# EAGLE design SP (EAGLE 7.1.0)

## Sheet 1 of 2
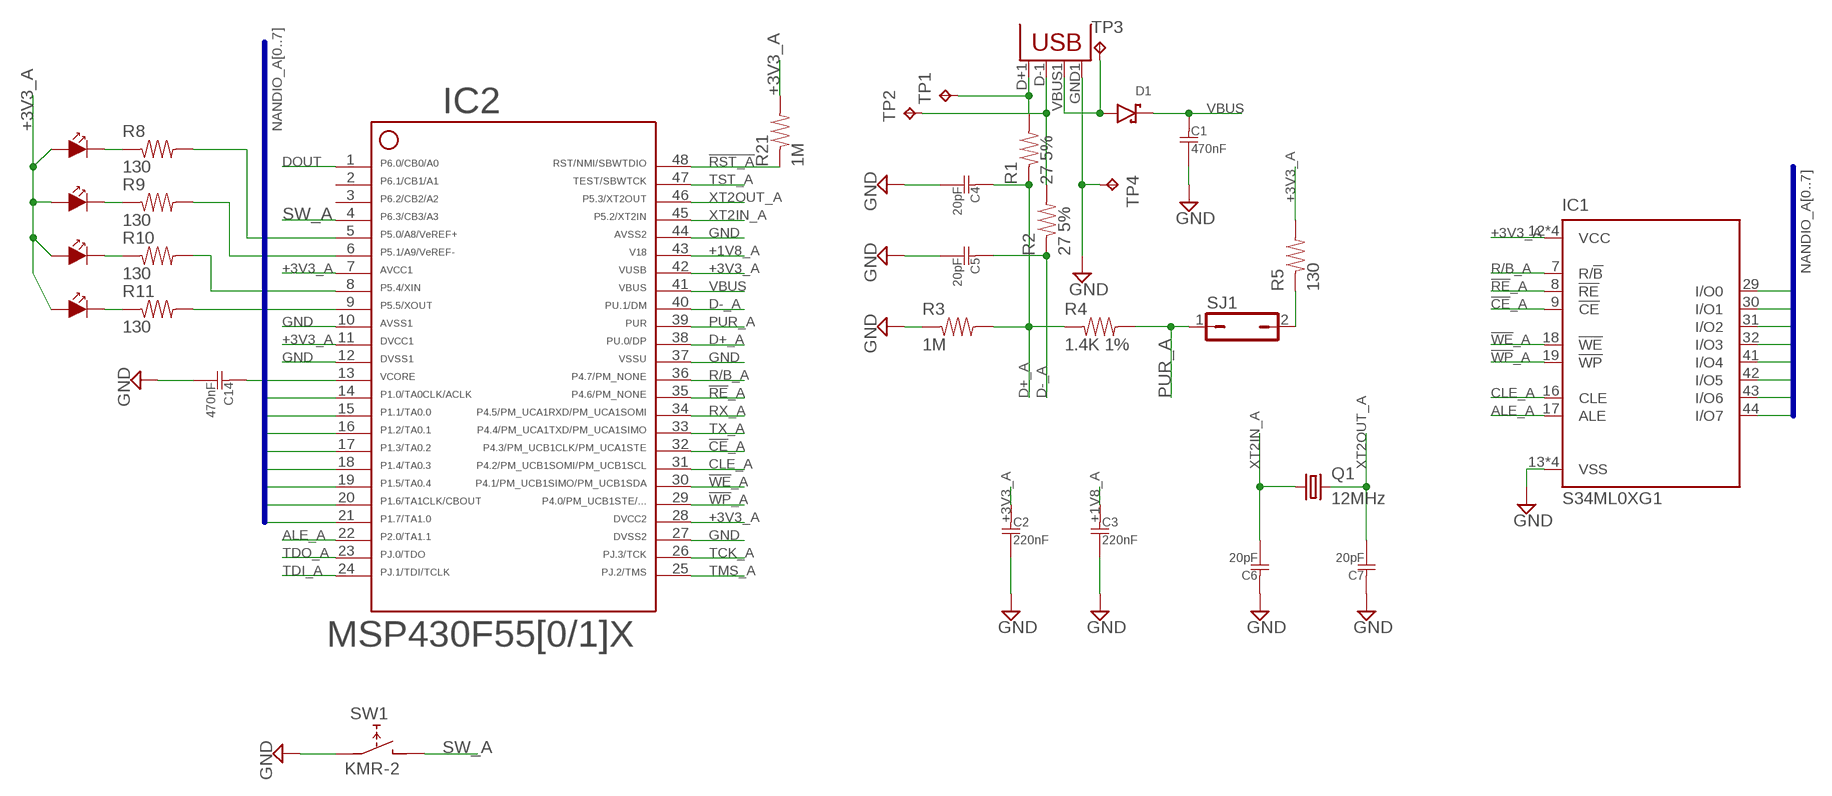
[diagram p0: schematic, sheet 1]

### Parts
C1  470nF  C0805  [R0805]
C2  220nF  C0805  [R0805]
C3  220nF  C0805  [R0805]
C4  20pF  C0805  [R0805]
C5  20pF  C0805  [R0805]
C6  20pF  C0805  [R0805]
C7  20pF  C0805  [R0805]
C14  470nF  C0805  [R0805]
D1  D-SCHOTTKY  [SOD123]
IC1  S34ML0XG1  [TSOP48]
IC2  F5508  F55[0/1]X---PT48  [PT48]
JP1  USBA-SMD-MALE  [USB-A-SMT-MALE]
Q1  12MHz  CRYSTALCSM-3X  [CSM-3X]
R1  27 5%  R0805  [R0805]
R2  27 5%  R0805  [R0805]
R3  1M  R0805  [R0805]
R4  1.4K 1%  R0805  [R0805]
R5  130  R0805  [R0805]
R8  130  R0805  [R0805]
R9  130  R0805  [R0805]
R10  130  R0805  [R0805]
R11  130  R0805  [R0805]
R21  1M  R0805  [R0805]
SJ1  JP1Q  [JP1]
SW1  KMR-2  [KMR-2-SWITCH]
TP1  TPTP13R  [TP13R]
TP2  TPTP13R  [TP13R]
TP3  TPTP13R  [TP13R]
TP4  TPTP13R  [TP13R]
U$5  LED  [LED0805]
U$6  LED  [LED0805]
U$7  LED  [LED0805]
U$8  LED  [LED0805]

### Nets
!CE!_A: IC1.9(!CE) IC2.32
!RE!_A: IC1.8(!RE) IC2.35
!RST_A!: IC2.48 R21.P$1
!WE!_A: IC1.18(!WE) IC2.30
!WP!_A: IC1.19(!WP) IC2.29
+1V8_A: C3.P$1 IC2.43
+3V3_A: C2.P$1 IC1.12(VCC) IC1.34(VCC) IC1.37(VCC) IC1.39(VCC) IC2.7 IC2.11 IC2.28 IC2.42 R5.P$2 R21.P$2 U$5.ANODE U$6.ANODE U$7.ANODE U$8.ANODE
ALE_A: IC1.17(ALE) IC2.22
CLE_A: IC1.16(CLE) IC2.31
D+_A: C4.P$1 IC2.38 R1.P$1 R3.P$2 R4.P$1
D-_A: C5.P$1 IC2.40 R2.P$1
DOUT: IC2.1 ; also sheet 2
GND: C1.P$2 C2.P$2 C3.P$2 C4.P$2 C5.P$2 C6.P$1 C7.P$1 C14.P$2 IC1.13(VSS) IC1.25(VSS) IC1.36(VSS) IC1.48(VSS) IC2.10 IC2.12 IC2.27 IC2.37 IC2.44 JP1.GND1(GND) R3.P$1 SW1.PA1(A1) SW1.PA2(A1) TP4.TP ; also sheet 2
N$1: JP1.D+1(D+) R1.P$2 TP1.TP
N$2: JP1.D-1(D-) R2.P$2 TP2.TP
N$3: C14.P$1 IC2.13
N$4: R5.P$1 SJ1.2
N$19: IC2.9 R11.P$2
N$22: R10.P$1 U$7.CATHODE
N$23: R9.P$1 U$6.CATHODE
N$24: R8.P$1 U$5.CATHODE
N$25: R11.P$1 U$8.CATHODE
N$26: IC2.8 R10.P$2
N$27: IC2.6 R9.P$2
N$28: IC2.5 R8.P$2
N$33: D1.ANODE JP1.VBUS1(VBUS) TP3.TP
NANDIO_A0: IC1.29(I/O0) IC2.14
NANDIO_A1: IC1.30(I/O1) IC2.15
NANDIO_A2: IC1.31(I/O2) IC2.16
NANDIO_A3: IC1.32(I/O3) IC2.17
NANDIO_A4: IC1.41(I/O4) IC2.18
NANDIO_A5: IC1.42(I/O5) IC2.19
NANDIO_A6: IC1.43(I/O6) IC2.20
NANDIO_A7: IC1.44(I/O7) IC2.21
PUR_A: IC2.39 R4.P$2 SJ1.1
R/B_A: IC1.7(R/!B) IC2.36
RX_A: IC2.34 ; also sheet 2
SW_A: IC2.4 SW1.PB1(B) SW1.PB2(B)
TCK_A: IC2.26
TDI_A: IC2.24
TDO_A: IC2.23
TMS_A: IC2.25
TST_A: IC2.47
TX_A: IC2.33 ; also sheet 2
VBUS: C1.P$1 D1.CATHODE IC2.41 ; also sheet 2
XT2IN_A: C6.P$2 IC2.45 Q1.P$1
XT2OUT_A: C7.P$2 IC2.46 Q1.P$2
Unconnected: IC2.2 IC2.3

### Buses
NANDIO_A[0..7]

## Sheet 2 of 2
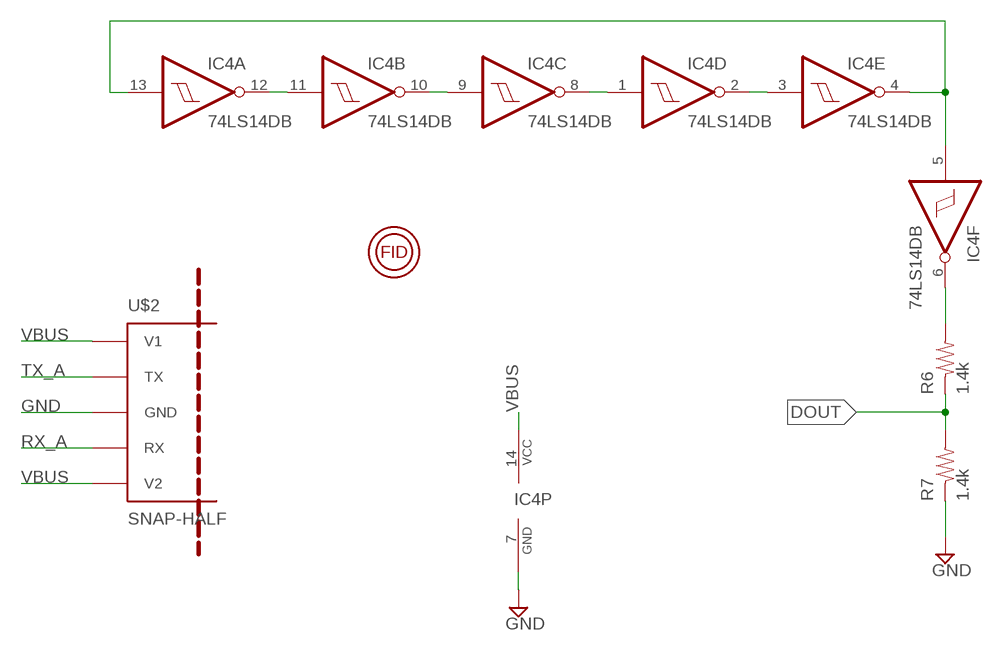
[diagram p1: schematic, sheet 2]

### Parts
IC4  74LS14DB  [SSOP14]
R6  1.4k  R0805  [R0805]
R7  1.4k  R0805  [R0805]
U$2  SNAP-HALF  [SNAP-HALF]
U$3  FIDUCAL  [FIDUCAL]

### Nets
DOUT: R6.P$1 R7.P$2 ; also sheet 1
GND: IC4.7(P:GND) R7.P$1 U$2.P$3(GND) ; also sheet 1
N$5: IC4.11(B:I) IC4.12(A:O)
N$6: IC4.9(C:I) IC4.10(B:O)
N$7: IC4.1(D:I) IC4.8(C:O)
N$8: IC4.2(D:O) IC4.3(E:I)
N$9: IC4.4(E:O) IC4.5(F:I) IC4.13(A:I)
N$10: IC4.6(F:O) R6.P$2
RX_A: U$2.P$4(RX) ; also sheet 1
TX_A: U$2.P$2(TX) ; also sheet 1
VBUS: IC4.14(P:VCC) U$2.P$1(V1) U$2.P$5(V2) ; also sheet 1

## Library data of the parts
C1-C7 C14 = Passives:C
D1 = Passives:D-SCHOTTKY
IC1 = Flash:S34ML0XG1: Spansion 1GB, 2GB, and 4GB x8 NAND Flash Memory In x8 I/O mode
IC2 = TI_MSP430_v16:F55[0/1]X---PT48: ***F55[0/1/2]X*** PT48 Rev. 1.0 06/2010 "http://www.ti.com/lit/gpn/msp430f5509" Only for FF5504, F5508,F5509,F5510
IC4 = 74xx-db-us:74*14: Hex schmitt trigger INVERTER
JP1 = Passives:USB: USB Connectors USB-B-PTH is fully proven SKU : PRT-00139/CONN-08278 USB-miniB is fully proven SKU : PRT-00587 USB-A-PCB is untested. USB-A-H is throughly reviewed, but untested. Spark Fun Electronics SKU : PRT-00437 USB-B-SMT is throughly reviewed, but untested. Needs silkscreen touching up. USB-A-S has not been used/tested USB-MB-H has not been used/tested USB-MICROB has been used. CONN-09505
Q1 = Passives:CRYSTAL: CRYSTAL
R1-R11 R21 = Passives:R: A standard resistor.
SJ1 = jumper:JP1Q: JUMPER
SW1 = Passives:KMR-2
TP1-TP4 = testpad:TP: Test pad
U$2 = Passives:SNAP-HALF
U$3 = Passives:FIDUCAL
U$5-U$8 = Passives:LED

## Board
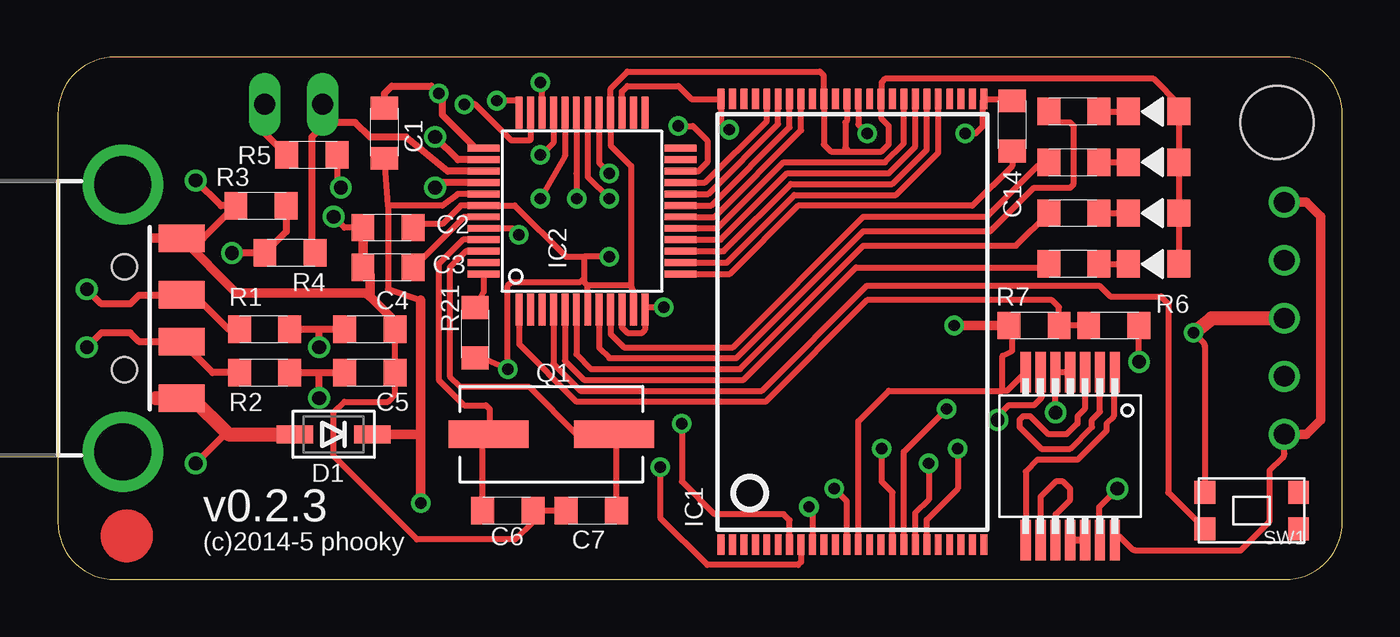
[diagram p2: board, top side]
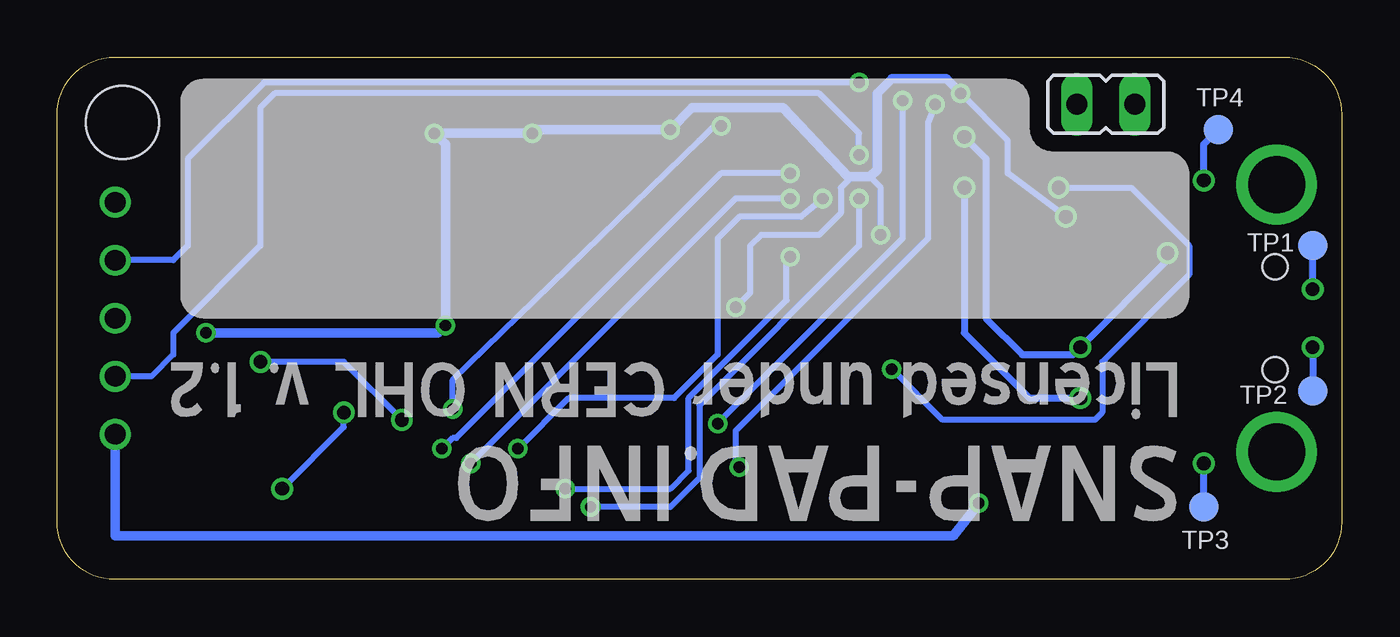
[diagram p3: board, bottom side, seen from below]

Size 56.2 x 22.86 mm. Coordinates in mm from the lower left corner, seen from the top.
Outline: 0,20.36 0,2.5 arc90 2.5,0 53.7,0 arc90 56.2,2.5 56.2,20.36 arc90 53.7,22.86 2.5,22.86 arc90 0,20.36
Copper layers (1*16): Top 0.0356mm / dielectric 1.5011mm / Bottom 0.0356mm
Design rules "LaenPCBOrder": minimum track width 6mil, minimum drill 13mil, track to track 6mil, track to pad 6mil, pad to pad 6mil, via to via 6mil, smd to smd 6mil, copper to edge 15mil, drill to drill 6mil, minimum pad ring 7mil, minimum via ring 7mil, stop-mask expansion 3mil, vias tented up to drill 0mil, thermal gap 10mil
Holes 3.2 mm at 53.34,20

### Footprints (pad centres in the part's own frame; a part is rotated, then mirrored left to right if it is on the bottom)
R0805 = smd 1 x 1.2: P$1 1.1,0; P$2 -1.1,0
SOD123 = smd 1.6 x 0.8: ANODE 1.7,0; CATHODE -1.7,0
TSOP48 = smd 0.9 x 0.3: 1 -9.75,5.75; 2 -9.75,5.25; 3 -9.75,4.75; 4 -9.75,4.25; 5 -9.75,3.75; 6 -9.75,3.25; 7 -9.75,2.75; 8 -9.75,2.25; 9 -9.75,1.75; 10 -9.75,1.25; 11 -9.75,0.75; 12 -9.75,0.25; 13 -9.75,-0.25; 14 -9.75,-0.75; 15 -9.75,-1.25; 16 -9.75,-1.75; 17 -9.75,-2.25; 18 -9.75,-2.75; 19 -9.75,-3.25; 20 -9.75,-3.75; 21 -9.75,-4.25; 22 -9.75,-4.75; 23 -9.75,-5.25; 24 -9.75,-5.75; 25 9.75,-5.75; 26 9.75,-5.25; 27 9.75,-4.75; 28 9.75,-4.25; 29 9.75,-3.75; 30 9.75,-3.25; 31 9.75,-2.75; 32 9.75,-2.25; 33 9.75,-1.75; 34 9.75,-1.25; 35 9.75,-0.75; 36 9.75,-0.25; 37 9.75,0.25; 38 9.75,0.75; 39 9.75,1.25; 40 9.75,1.75; 41 9.75,2.25; 42 9.75,2.75; 43 9.75,3.25; 44 9.75,3.75; 45 9.75,4.25; 46 9.75,4.75; 47 9.75,5.25; 48 9.75,5.75
PT48 = smd 1.4 x 0.3: 1 -4.3,2.75; 2 -4.3,2.25; 3 -4.3,1.75; 4 -4.3,1.25; 5 -4.3,0.75; 6 -4.3,0.25; 7 -4.3,-0.25; 8 -4.3,-0.75; 9 -4.3,-1.25; 10 -4.3,-1.75; 11 -4.3,-2.25; 12 -4.3,-2.75; 25 4.3,-2.75; 26 4.3,-2.25; 27 4.3,-1.75; 28 4.3,-1.25; 29 4.3,-0.75; 30 4.3,-0.25; 31 4.3,0.25; 32 4.3,0.75; 33 4.3,1.25; 34 4.3,1.75; 35 4.3,2.25; 36 4.3,2.75 | smd 0.3 x 1.4: 13 -2.75,-4.3; 14 -2.25,-4.3; 15 -1.75,-4.3; 16 -1.25,-4.3; 17 -0.75,-4.3; 18 -0.25,-4.3; 19 0.25,-4.3; 20 0.75,-4.3; 21 1.25,-4.3; 22 1.75,-4.3; 23 2.25,-4.3; 24 2.75,-4.3; 37 2.75,4.3; 38 2.25,4.3; 39 1.75,4.3; 40 1.25,4.3; 41 0.75,4.3; 42 0.25,4.3; 43 -0.25,4.3; 44 -0.75,4.3; 45 -1.25,4.3; 46 -1.75,4.3; 47 -2.25,4.3; 48 -2.75,4.3
SSOP14 = smd 0.451 x 1.766: 1 -1.95,-3.675; 2 -1.3,-3.675; 3 -0.65,-3.675; 4 0,-3.675; 5 0.65,-3.675; 6 1.3,-3.675; 7 1.95,-3.675; 8 1.95,3.675; 9 1.3,3.675; 10 0.65,3.675; 11 0,3.675; 12 -0.65,3.675; 13 -1.3,3.675; 14 -1.95,3.675
USB-A-SMT-MALE = smd 1.2 x 2: D+1 1.027,-3.67; D-1 -1.027,-3.67; GND1 3.5,-3.67; VBUS1 -3.5,-3.67 | drill 2.5 pad 2.9: P$1 -5.85,-1.1; P$2 5.85,-1.1 | hole 1.1: 2.25,-1.17; -2.25,-1.17
CSM-3X = smd 3.5 x 1.2: P$1 -2.75,0; P$2 2.75,0
JP1 = drill 0.914 long: 1 0,-1.27; 2 0,1.27
KMR-2-SWITCH = smd 0.9 x 1: PA1 -2.05,-0.8; PA2 2.05,-0.8; PB1 -2.05,0.8; PB2 2.05,0.8
TP13R = smd 1.3 x 1.3: TP 0,0
SNAP-HALF = drill 0.9: P$1 -3.81,5.08; P$2 -3.81,2.54; P$3 -3.81,0; P$4 -3.81,-2.54; P$5 -3.81,-5.08
LED0805 = smd 1 x 1.2: ANODE -1.1,0; CATHODE 1.1,0

### Placement (x,y rotation side)
C1  14.29,19.53 270 top
C2  14.45,15.4 0 top
C3  14.45,13.65 0 top
C4  13.65,10.95 180 top
C5  13.65,9.05 180 top
C6  19.68,3.02 0 top
C7  23.34,3.02 180 top
C14  41.75,19.84 270 top
D1  12.07,6.35 180 top
IC1  34.77,11.27 90 top
IC2  22.93,16.12 90 top
IC4  44.29,5.4 180 top
JP1  1.75,11.43 90 top
Q1  21.59,6.35 0 top
R1  9.05,10.95 0 top
R2  9.05,9.05 0 top
R3  8.89,16.35 180 top
R4  10.16,14.29 180 top
R5  11.11,18.57 180 top
R6  46.2,11.11 180 top
R7  42.7,11.11 180 top
R8  44.45,13.81 0 top
R9  44.45,16.03 0 top
R10  44.45,20.48 0 top
R11  44.45,18.26 0 top
R21  18.26,10.79 90 top
SJ1  10.32,20.8 270 bottom
SW1  52.23,3.02 180 top
TP1  1.27,14.61 0 bottom
TP2  1.27,8.26 0 bottom
TP3  6.03,3.17 0 bottom
TP4  5.4,19.68 0 bottom
U$2  57.47,11.43 180 bottom
U$3  3.02,1.91 0 top
U$5  47.94,13.81 180 top
U$6  47.94,16.03 180 top
U$7  47.94,20.48 180 top
U$8  47.94,18.26 180 top

### Tracks (layer width: path | path; a pad name or v marks a point on that pad's centre or on a via)
!CE!_A  (via drill 0.5)
  Top 0.254: IC2.32 22.18,18.53 v21.11,16.67 | v32.86,3.17 33.02,3.02 IC1.9
  Bottom 0.254: v21.11,16.67 21.11,14.61 28.1,7.62 28.1,4.45 29.37,3.17 v32.86,3.17
!RE!_A  (via drill 0.5)
  Top 0.254: IC2.35 20.68,19.25 20.64,19.21 19.84,19.21 18.26,20.8 v17.78,20.8 | v26.35,4.92 26.35,2.7 28.42,0.64 32.38,0.64 32.52,0.77 IC1.8
  Bottom 0.254: v17.78,20.8 18.1,20 18.1,14.92 26.51,6.51 26.51,5.08 v26.35,4.92
!RST_A!
  Top 0.254: IC2.48 18.63,12.59 R21.P$1
!WE!_A  (via drill 0.5)
  Top 0.254: IC2.30 23.18,17.61 v24.13,16.67 | v38.1,5.08 38.1,3.49 37.52,2.91 IC1.18
  Bottom 0.254: v24.13,16.67 26.51,16.67 v38.1,5.08
!WP!_A  (via drill 0.5)
  Top 0.254: IC2.29 23.68,18.23 v24.13,17.78 | v39.37,5.71 39.37,3.97 38.02,2.62 IC1.19
  Bottom 0.254: v24.13,17.78 27.15,17.78 38.73,6.19 38.89,6.19 v39.37,5.71
+1V8_A
  Top 0.254: IC2.43 17.77,15.87 C3.P$1
+3V3_A  (via drill 0.5, 0.6)
  Top 0.254: IC2.11 25.18,12.6 25.08,12.86 | 25.08,12.86 23.18,12.86 | IC2.7 23.18,12.55 23.18,12.86 | U$5.ANODE U$6.ANODE U$8.ANODE U$7.ANODE 49.04,20.81 47.94,21.91 36.2,21.91 36.04,21.75 36.04,21.04 IC1.34 36.04,21 36.04,20.16 36.35,19.84 36.35,19.05 36.04,18.73 34.61,18.73 | IC1.37 34.52,20.07 34.45,20 34.45,18.89 34.61,18.73 | 34.61,18.73 33.81,18.73 33.52,19.03 IC1.39 33.5,21.04 33.5,22.07 33.34,22.23 24.92,22.23 24.18,21.48 IC2.28 24.18,19 25.08,18.1 25.08,12.86 | 23.18,12.86 23.02,13.02 23.02,13.18 | 23.02,14.13 22.23,14.13 19.98,16.37 IC2.42 17.64,16.37 16.83,15.56 15.71,15.56 C2.P$1 | 23.02,14.13 23.02,13.18 | IC1.12 34.52,3.42 v33.97,3.97 | v24.13,14.13 23.02,14.13 | R21.P$2 18.59,9.7 v19.68,9.21 19.68,12.86 19.84,13.02 22.86,13.02 23.02,13.18 | R5.P$2 12.21,17.32 v12.38,17.14
  Bottom 0.254: v33.97,3.97 29.37,3.97 28.57,4.76 28.57,7.94 24.29,12.22 24.29,13.97 v24.13,14.13 | v19.68,9.21 17.46,6.99 10.79,6.99 10.48,7.3 10.48,9.53 6.67,13.34 6.67,14.61 9.21,17.14 v12.38,17.14
ALE_A  (via drill 0.5)
  Top 0.254: IC1.17 37.02,5.58 v38.89,7.46 | v27.15,19.84 27.78,19.84 28.42,19.21 28.42,18.26 28.03,17.87 IC2.22
  Bottom 0.254: v38.89,7.46 38.89,8.73 28.1,19.21 27.46,19.84 v27.15,19.84
CLE_A  (via drill 0.5)
  Top 0.254: IC2.31 22.68,17.76 v22.7,16.67 | IC1.16 36.52,3.81 36.04,4.29 v36.04,5.71
  Bottom 0.254: v22.7,16.67 23.65,15.88 26.35,15.88 27.3,14.92 27.3,9.84 29.21,7.94 33.81,7.94 v36.04,5.71
D+_A  (via drill 0.6)
  Top 0.305: R1.P$1 11.43,10.95 | 11.43,10.95 C4.P$1 | IC2.38 17.51,18.37 v16.51,19.37 | v11.43,10.16 11.43,10.95 | R3.P$2 9.99,15.22 R4.P$1 v7.62,14.29
  Bottom 0.305: v16.51,19.37 15.56,18.41 15.56,11.43 13.97,9.84 11.75,9.84 v11.43,10.16 7.62,13.97 v7.62,14.29
D-_A  (via drill 0.6)
  Top 0.305: R2.P$1 11.43,9.05 | 11.43,9.05 C5.P$1 | IC2.40 16.73,17.37 v16.51,17.14 | v11.43,7.94 11.43,9.05
  Bottom 0.305: v16.51,17.14 16.51,10.79 13.65,7.94 v11.43,7.94
DOUT
  Top 0.254: IC2.1 20.18,10.3 22.7,7.78 30.96,7.78 35.4,12.22 43.5,12.22 43.8,11.92 R7.P$2 R6.P$1
GND  (via drill 0.5, 0.6)
  Top 0.254: IC2.10 24.68,11.04 24.92,10.79 25.56,10.79 25.68,10.92 IC2.12 25.77,11.91 v26.51,11.91 | IC1.36 35.02,19.91 v35.4,19.53 | v39.69,19.53 40.16,19.53 40.48,19.84 40.48,20.99 IC1.25 41.67,21.02 C14.P$2 | IC1.13 35.02,6.92 36.35,8.26 41.33,8.26 | IC2.27 24.68,21.35 24.92,21.59 27.15,21.59 27.71,21.02 IC1.48 29.02,20.04 v29.37,19.68 | IC2.37 18.44,18.87 | C4.P$2 C5.P$2 14.76,9.04 14.76,8.1 14.45,7.78 12.54,7.78 12.07,7.3 12.07,5.4 15.72,1.75 20,1.75 20.79,2.53 C6.P$1 C7.P$1 | 41.33,8.26 41.33,9.79 41.75,10 41.75,10.96 R7.P$1 | IC2.44 19.87,15.37 v20.16,15.08 | C2.P$2 12.54,15.4 v12.07,15.88 | IC4.7 41.52,8.26 41.33,8.26 | v49.69,10.79 50.1,10.38 arc-45 50.18,10.2 SW1.PA2
  Top 0.305: IC2.37 18.28,18.87 16.83,20.32 16.83,21.11 v16.67,21.27 16.35,21.59 14.61,21.59 14.29,21.27 C1.P$2 | JP1.GND1 6.37,14.93 R3.P$1 7.14,16.35 v6.03,17.46
  Top 0.406: 4.13,14.93 JP1.GND1 7.8,12.54 13.49,12.54 13.65,12.38 | C2.P$2 C3.P$2 13.65,13.35 13.65,12.38 | v39.21,11.11 R7.P$1 | C4.P$2 14.75,11.28 13.65,12.38
  Top 0.61: U$2.P$3 50.48,11.43 v49.69,10.79
  Bottom 0.254: 35.24,19.68 v35.4,19.53 | 21.59,17.62 21.59,17.46 21.91,17.14 21.91,16.03 22.86,15.08 25.4,15.08 25.88,14.61 25.88,12.54 v26.51,11.91 | v20.16,15.08 20.16,17.14 20.64,17.62 | v12.07,15.88 14.61,17.78 14.61,19.21 v16.67,21.27
  Bottom 0.305: v6.03,17.46 6.03,19.05 TP4.TP
  Bottom 0.406: v35.4,19.53 v39.69,19.53 39.21,19.05 v39.21,11.11 39.53,10.79 v49.69,10.79 | 35.24,19.68 v29.37,19.68 28.42,20.64 24.45,20.64 21.59,17.62 20.64,17.62 20.32,17.94 20.32,21.27 19.68,21.91 17.3,21.91 v16.67,21.27
N$1  (via drill 0.6)
  Top 0.254: JP1.D+1 4.57,12.43
  Top 0.305: 4.57,12.43 3.54,12.43 3.18,12.06 1.9,12.06 v1.27,12.7 | R1.P$2 7.46,10.95 6.03,12.38 5.49,12.38 JP1.D+1
  Bottom 0.305: v1.27,12.7 TP1.TP
N$2  (via drill 0.6)
  Top 0.254: JP1.D-1 4.66,10.43
  Top 0.305: v1.27,10.16 1.9,10.79 3.18,10.79 3.57,10.4 JP1.D-1 6.77,9.05 R2.P$2
  Bottom 0.305: v1.27,10.16 TP2.TP
N$3
  Top 0.254: C14.P$1 41.75,18.1 40,16.35 32.38,16.35 29.4,13.37 IC2.13
N$4
  Top 0.305: SJ1.2 9.05,19.54 R5.P$1
N$5
  Top 0.305: IC4.11 IC4.12
N$6
  Top 0.254: IC4.10 43.66,1.74 43.66,2.86 44.29,3.49 44.29,3.97 43.97,4.29 43.66,4.29 42.99,3.62 IC4.9
N$7
  Top 0.254: IC4.1 46.2,9.03 46.2,7.14 45.88,6.83 45.88,6.51 44.61,5.24 42.86,5.24 42.34,4.72 IC4.8
N$8
  Top 0.254: IC4.3 44.93,9.06 44.93,7.46 44.61,7.14 44.61,6.83 44.13,6.35 43.34,6.35 42.54,7.14 42.23,7.14 42.07,6.99 42.07,6.67 43.02,5.71 44.29,5.71 45.24,6.67 45.24,6.99 45.59,7.33 IC4.2
N$9  (via drill 0.6)
  Top 0.254: IC4.13 45.56,1.75 45.56,3.17 v46.35,3.97 | v43.66,7.3 43.64,7.32 IC4.5 IC4.4
  Bottom 0.254: v46.35,3.97 43.66,6.67 v43.66,7.3
N$10  (via drill 0.6)
  Top 0.254: IC4.6 43.02,9.04 43.02,7.94 42.7,7.62 41.59,7.62 41.12,7.14 v41.12,6.99 | v47.31,9.53 47.3,9.54 R6.P$2
  Bottom 0.254: v41.12,6.99 43.66,9.53 v47.31,9.53
N$19
  Top 0.254: IC2.9 24.18,10.74 24.77,10.16 29.53,10.16 35.24,15.88 40.64,15.88 42.86,18.1 43.19,18.1 R11.P$2
N$22
  Top 0.254: R10.P$1 U$7.CATHODE
N$23
  Top 0.254: R9.P$1 U$6.CATHODE
N$24
  Top 0.254: R8.P$1 U$5.CATHODE
N$25
  Top 0.254: R11.P$1 U$8.CATHODE
N$26
  Top 0.254: IC2.8 23.68,10.13 24.13,9.68 29.69,9.68 35.24,15.24 40.8,15.24 42.7,17.14 44.29,17.14 44.45,17.3 44.45,19.84 44.29,20 43.83,20 R10.P$2
N$27
  Top 0.254: IC2.6 22.68,9.86 23.34,9.21 29.84,9.21 35.24,14.61 41.92,14.61 R9.P$2
N$28
  Top 0.254: IC2.5 22.18,9.57 23.02,8.73 30,8.73 34.92,13.65 43.03,13.65 R8.P$2
N$33  (via drill 0.6)
  Top 0.305: v6.03,5.08 7.38,6.43
  Top 0.61: 4.29,7.93 JP1.VBUS1 5.88,7.93 7.38,6.43 7.46,6.35 D1.ANODE
  Bottom 0.305: TP3.TP v6.03,5.08
NANDIO_A0
  Top 0.254: IC2.14 29.27,13.87 32.23,16.83 36.67,16.83 38.52,18.67 IC1.29
NANDIO_A1
  Top 0.254: IC2.15 29.13,14.37 32.07,17.3 36.51,17.3 38.02,18.81 IC1.30
NANDIO_A2
  Top 0.254: IC2.16 29,14.87 31.91,17.78 36.35,17.78 37.52,18.94 IC1.31
NANDIO_A3
  Top 0.254: IC2.17 28.86,15.37 31.75,18.26 36.2,18.26 37.02,19.08 IC1.32
NANDIO_A4
  Top 0.254: IC2.18 28.73,15.87 32.52,19.66 IC1.41
NANDIO_A5
  Top 0.254: IC2.19 28.59,16.37 32.02,19.79 IC1.42
NANDIO_A6
  Top 0.254: IC2.20 28.46,16.87 31.52,19.93 IC1.43
NANDIO_A7
  Top 0.254: IC2.21 28.32,17.37 31.02,20.06 IC1.44
PUR_A
  Top 0.305: SJ1.1 11.59,20 | 11.59,20 11.59,19.84 11.11,19.37 11.11,14.44 R4.P$2 | IC2.39 17.06,17.87 15.24,19.37 13.65,19.37 13.02,20 11.59,20
R/B_A  (via drill 0.5)
  Top 0.254: IC2.36 20.18,20.61 20.16,20.95 v19.21,20.95 | v27.3,6.83 27.3,4.29 28.73,2.86 31.75,2.86 32.02,2.59 IC1.7
  Bottom 0.254: v19.21,20.95 19.21,14.92 v27.3,6.83
RX_A  (via drill 0.5)
  Top 0.254: IC2.34 21.18,21.36 v21.11,21.75
  Bottom 0.254: v21.11,21.75 47.15,21.75 50.48,18.41 50.48,14.61 51.12,13.97 U$2.P$4
SW_A
  Top 0.254: IC2.4 21.68,9.43 22.86,8.26 30.8,8.26 35.4,12.86 45.56,12.86 46.04,12.38 48.26,12.38 48.58,12.06 48.58,3.79 arc-45 48.62,3.77 SW1.PB2
TX_A  (via drill 0.5)
  Top 0.254: IC2.33 21.68,19.11 v21.11,18.57
  Bottom 0.254: v21.11,18.57 21.11,19.53 22.86,21.27 46.67,21.27 47.31,20.64 47.31,14.61 51.12,10.79 51.12,9.84 52.07,8.89 U$2.P$2
VBUS  (via drill 0.5)
  Top 0.254: IC2.41 17.5,16.87 16.83,16.35 14.45,16.35 | 14.45,16.35 14.45,12.7 15.88,12.22 | 14.45,16.35 14.45,16.36 C1.P$1 | IC4.14 46.42,1.91 46.98,1.34 arc45 47.16,1.27 51.75,1.27 52.95,2.47 arc45 53.02,2.65 53.02,4.76 53.58,5.32 arc45 53.66,5.5 U$2.P$1
  Top 0.406: D1.CATHODE 15.88,6.35 | 15.88,12.22 15.88,6.35 | U$2.P$5 54.61,16.51 55.24,15.88 55.24,6.99 54.61,6.35 U$2.P$1 | v15.88,3.33 15.88,6.35
  Bottom 0.406: U$2.P$1 53.66,1.91 16.99,1.91 v15.88,3.33
XT2IN_A
  Top 0.254: IC2.45 17.73,14.87 16.67,13.81 16.67,8.73 17.78,7.62 18.73,7.62 18.89,7.46 18.89,6.4 Q1.P$1 18.59,6.09 C6.P$2
XT2OUT_A
  Top 0.254: IC2.46 17.86,14.37 17.14,13.65 17.14,8.89 17.62,8.41 20.64,8.41 22.7,6.35 Q1.P$2 24.44,6.25 C7.P$2

### Text on the board
tNames: v0.2.3 | (c)2014-5 phooky